# EAGLE design GTwoShield4PATCH2 (EAGLE 9.2.2)

## Sheet 1 of 2
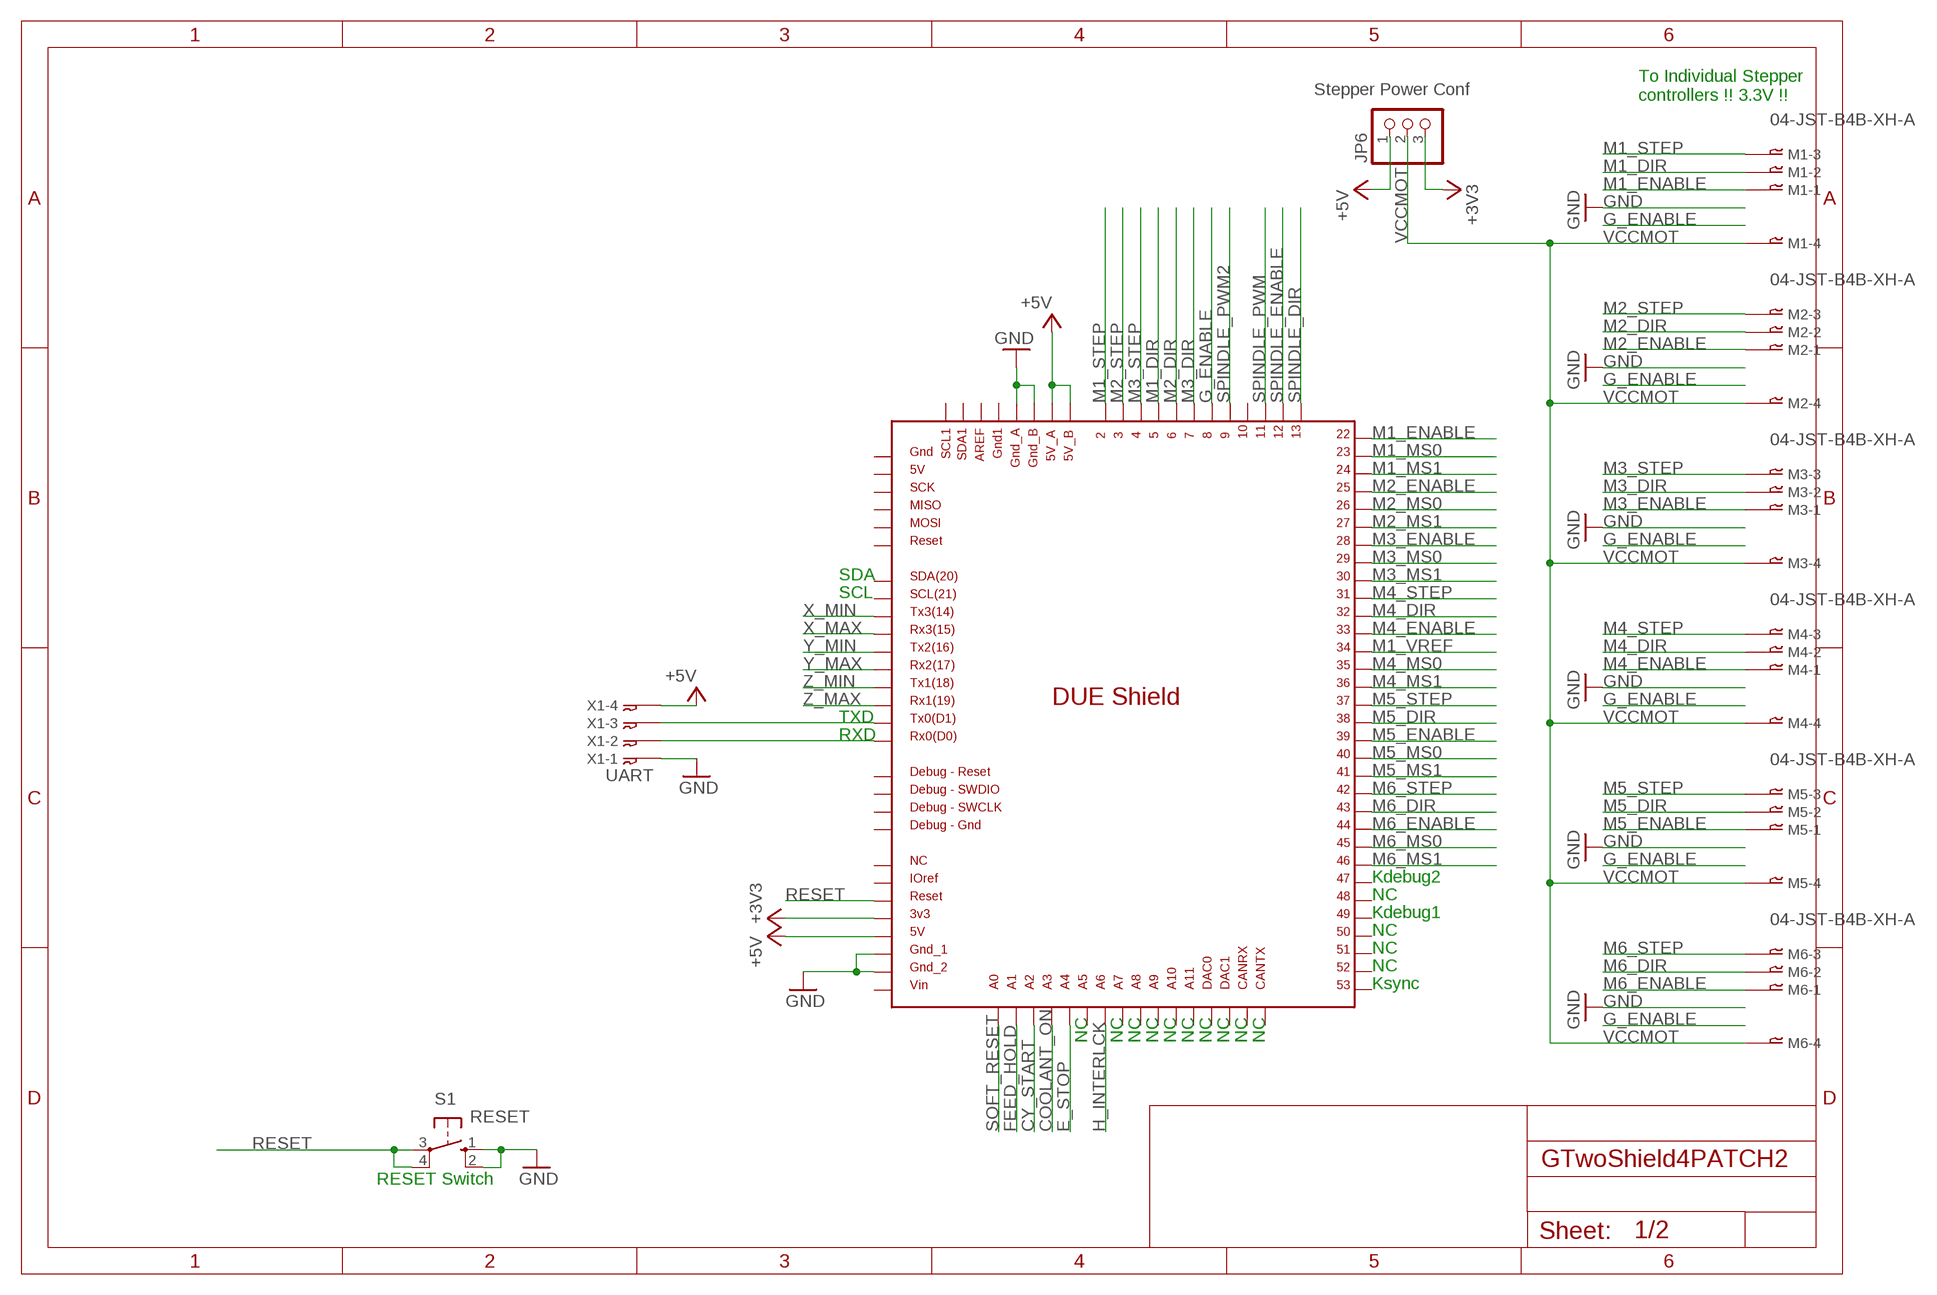
[diagram p0: schematic, sheet 1]

### Parts
JP6  Stepper Power Conf  PINHD-1X3  [1X03]
M1  04-JST-B4B-XH-A  [B4B-XH]
M2  04-JST-B4B-XH-A  [B4B-XH]
M3  04-JST-B4B-XH-A  [B4B-XH]
M4  04-JST-B4B-XH-A  [B4B-XH]
M5  04-JST-B4B-XH-A  [B4B-XH]
M6  04-JST-B4B-XH-A  [B4B-XH]
S1  RESET  10-XX  [B3F-10XX]
U$1  DUE(NORMAL)  [DUE(NORMAL)]
X1  UART  04-JST-B4B-XH-A  [B4B-XH]

### Nets
+3V3: JP6.3 U$1.3V3 ; also sheet 2
+5V [POWER]: JP6.1 U$1.5V U$1.5V_A U$1.5V_B X1.P$4 ; also sheet 2
COOLANT_ON: U$1.A3 ; also sheet 2
CY_START: U$1.A2 ; also sheet 2
E_STOP: U$1.A4 ; also sheet 2
FEED_HOLD: U$1.A1 ; also sheet 2
G_ENABLE: U$1.8
GND [POWER]: S1.1(S) S1.2(S1) U$1.GND_1 U$1.GND_2 U$1.GND_A U$1.GND_B X1.P$1 ; also sheet 2
H_INTERLCK: U$1.A6
M1_DIR: M1.P$2 U$1.5
M1_ENABLE: M1.P$1 U$1.22
M1_MS0: U$1.23
M1_MS1: U$1.24
M1_STEP: M1.P$3 U$1.2
M1_VREF: U$1.34
M2_DIR: M2.P$2 U$1.6
M2_ENABLE: M2.P$1 U$1.25
M2_MS0: U$1.26
M2_MS1: U$1.27
M2_STEP: M2.P$3 U$1.3
M3_DIR: M3.P$2 U$1.7
M3_ENABLE: M3.P$1 U$1.28
M3_MS0: U$1.29
M3_MS1: U$1.30
M3_STEP: M3.P$3 U$1.4
M4_DIR: M4.P$2 U$1.32
M4_ENABLE: M4.P$1 U$1.33
M4_MS0: U$1.35
M4_MS1: U$1.36
M4_STEP: M4.P$3 U$1.31
M5_DIR: M5.P$2 U$1.38
M5_ENABLE: M5.P$1 U$1.39
M5_MS0: U$1.40
M5_MS1: U$1.41
M5_STEP: M5.P$3 U$1.37
M6_DIR: M6.P$2 U$1.43
M6_ENABLE: M6.P$1 U$1.44
M6_MS0: U$1.45
M6_MS1: U$1.46
M6_STEP: M6.P$3 U$1.42
N$6: U$1.TX0 X1.P$3
N$23: U$1.RX0 X1.P$2
RESET: S1.3(P) S1.4(P1) U$1.RESET
SOFT_RESET: U$1.A0 ; also sheet 2
SPINDLE_DIR: U$1.13 ; also sheet 2
SPINDLE_ENABLE: U$1.12 ; also sheet 2
SPINDLE_PWM: U$1.11 ; also sheet 2
SPINDLE_PWM2: U$1.9
VCCMOT: JP6.2 M1.P$4 M2.P$4 M3.P$4 M4.P$4 M5.P$4 M6.P$4
X_MAX: U$1.RX3 ; also sheet 2
X_MIN: U$1.TX3 ; also sheet 2
Y_MAX: U$1.RX2 ; also sheet 2
Y_MIN: U$1.TX2 ; also sheet 2
Z_MAX: U$1.RX1 ; also sheet 2
Z_MIN: U$1.TX1 ; also sheet 2
Unconnected: U$1.5V_ICSP U$1.10 U$1.47 U$1.48 U$1.49 U$1.50 U$1.51 U$1.52 U$1.53 U$1.A5 U$1.A7 U$1.A8 U$1.A9 U$1.A10 U$1.A11 U$1.AREF U$1.CANRX U$1.CANTX U$1.DAC0 U$1.DAC1 U$1.GND1 U$1.GND_DEBUG U$1.GND_ICSP U$1.IOREF U$1.MISO_ICSP U$1.MOSI_ICSP U$1.NC U$1.RESET_DEBUG U$1.RESET_ICSP U$1.SCK_ICSP U$1.SCL U$1.SCL1 U$1.SDA U$1.SDA1 U$1.SWCLK_DEBUG U$1.SWDIO_DEBUG U$1.VIN

### Notes on the sheet
- To Individual Stepper 
  controllers !! 3.3V !!
- SDA
- SCL
- TXD
- RXD
- Kdebug2
- NC
- Kdebug1
- NC
- NC
- NC
- Ksync
- NC | NC | NC | NC | NC | NC | NC | NC | NC | NC
- RESET Switch

## Sheet 2 of 2
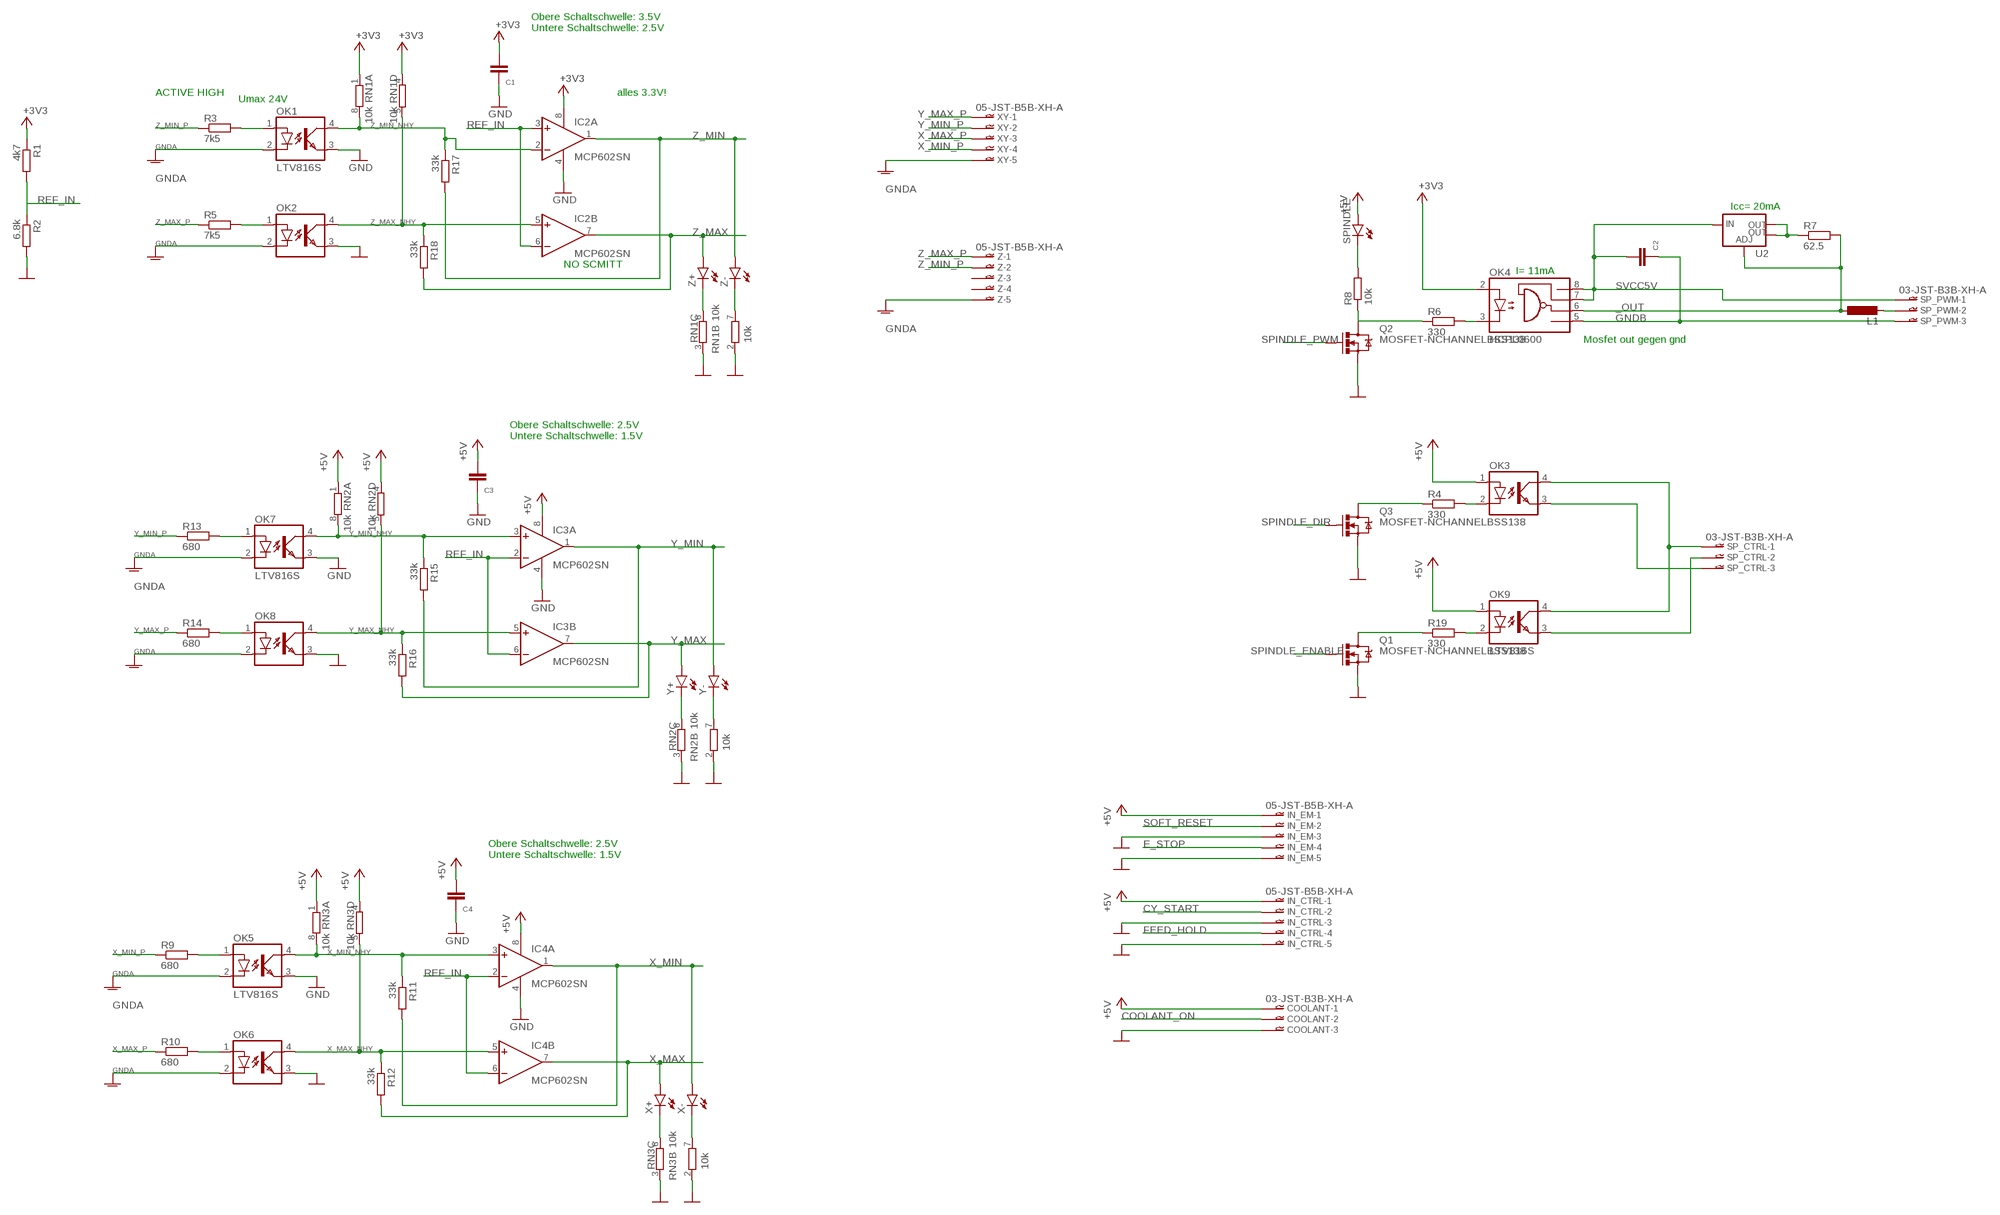
[diagram p1: schematic, sheet 2]

### Parts
C1  100nf  C-EUC0603K  [C0603K]
C2  100nf  C-EUC0603K  [C0603K]
C3  100nf  C-EUC0603K  [C0603K]
C4  100nf  C-EUC0603K  [C0603K]
COOLANT  03-JST-B3B-XH-A  [B3B-XH]
IC2  MCP602SN  [SO08]
IC3  MCP602SN  [SO08]
IC4  MCP602SN  [SO08]
IN_CTRL  05-JST-B5B-XH-A  [B5B-XH]
IN_EM  05-JST-B5B-XH-A  [B5B-XH]
L1  L-EU0207/10  [0207/10]
OK1  LTV816S  [DIL4-SMD]
OK2  LTV816S  [DIL4-SMD]
OK3  LTV816S  [DIL4-SMD]
OK4  HCPL0600  [SOIC08]
OK5  LTV816S  [DIL4-SMD]
OK6  LTV816S  [DIL4-SMD]
OK7  LTV816S  [DIL4-SMD]
OK8  LTV816S  [DIL4-SMD]
OK9  LTV816S  [DIL4-SMD]
Q1  MOSFET-NCHANNELBSS138  [SOT23]
Q2  MOSFET-NCHANNELBSS138  [SOT23]
Q3  MOSFET-NCHANNELBSS138  [SOT23]
R1  4k7  R-EU_R0805  [R0805]
R2  6.8k  R-EU_R0805  [R0805]
R3  7k5  R-EU_R0805  [R0805]
R4  330  R-EU_R0805  [R0805]
R5  7k5  R-EU_R0805  [R0805]
R6  330  R-EU_R0805  [R0805]
R7  62.5  R-EU_R0805  [R0805]
R8  10k  R-EU_R0805  [R0805]
R9  680  R-EU_R0805  [R0805]
R10  680  R-EU_R0805  [R0805]
R11  33k  R-EU_R0805  [R0805]
R12  33k  R-EU_R0805  [R0805]
R13  680  R-EU_R0805  [R0805]
R14  680  R-EU_R0805  [R0805]
R15  33k  R-EU_R0805  [R0805]
R16  33k  R-EU_R0805  [R0805]
R17  33k  R-EU_R0805  [R0805]
R18  33k  R-EU_R0805  [R0805]
R19  330  R-EU_R0805  [R0805]
RN1  10k  4R-N0603-ARC  [0603-ARC]
RN2  10k  4R-N0603-ARC  [0603-ARC]
RN3  10k  4R-N0603-ARC  [0603-ARC]
SP_CTRL  03-JST-B3B-XH-A  [B3B-XH]
SP_PWM  03-JST-B3B-XH-A  [B3B-XH]
SPINDLE  LEDCHIP-LED0805  [CHIP-LED0805]
U2  V_REG_LM1117SOT223  [SOT223]
X+  LEDCHIP-LED0805  [CHIP-LED0805]
X-  LEDCHIP-LED0805  [CHIP-LED0805]
XY  05-JST-B5B-XH-A  [B5B-XH]
Y+  LEDCHIP-LED0805  [CHIP-LED0805]
Y-  LEDCHIP-LED0805  [CHIP-LED0805]
Z  05-JST-B5B-XH-A  [B5B-XH]
Z+  LEDCHIP-LED0805  [CHIP-LED0805]
Z-  LEDCHIP-LED0805  [CHIP-LED0805]

### Nets
+3V3: C1.2 IC2.8(P:V+) OK4.2(A) R1.1 RN1.1 RN1.4 ; also sheet 1
+5V [POWER]: C3.2 C4.2 COOLANT.P$1 IC3.8(P:V+) IC4.8(P:V+) IN_CTRL.P$1 IN_EM.P$1 OK3.1(A) OK9.1(A) RN2.1 RN2.4 RN3.1 RN3.4 SPINDLE.A ; also sheet 1
_OUT: L1.1 OK4.6(VO) R7.2 U2.1(ADJ)
COOLANT_ON: COOLANT.P$2 ; also sheet 1
CY_START: IN_CTRL.P$2 ; also sheet 1
E_STOP: IN_EM.P$4 ; also sheet 1
FEED_HOLD: IN_CTRL.P$4 ; also sheet 1
GND [POWER]: C1.1 C3.1 C4.1 COOLANT.P$3 IC2.4(P:V-) IC3.4(P:V-) IC4.4(P:V-) IN_CTRL.P$3 IN_CTRL.P$5 IN_EM.P$3 IN_EM.P$5 OK1.3(EMIT) OK2.3(EMIT) OK5.3(EMIT) OK6.3(EMIT) OK7.3(EMIT) OK8.3(EMIT) Q1.2(S) Q2.2(S) Q3.2(S) R2.2 RN1.2 RN1.3 RN2.2 RN2.3 RN3.2 RN3.3 ; also sheet 1
GNDA: OK1.2(C) OK2.2(C) OK5.2(C) OK6.2(C) OK7.2(C) OK8.2(C) XY.P$5 Z.P$5
GNDB [POWER]: C2.1 OK4.5(GND) SP_PWM.P$3
N$1: RN1.6 Z+.C
N$2: OK1.1(A) R3.2
N$3: OK2.1(A) R5.2
N$4: RN1.7 Z-.C
N$5: OK9.2(C) R19.2
N$7: Q1.3(D) R19.1
N$8: OK4.3(C) R6.2
N$9: OK5.1(A) R9.2
N$10: OK6.1(A) R10.2
N$11: OK7.1(A) R13.2
N$12: OK8.1(A) R14.2
N$13: RN2.6 Y+.C
N$14: RN2.7 Y-.C
N$15: RN3.6 X+.C
N$16: RN3.7 X-.C
N$17: Q2.3(D) R6.1 R8.1
N$18: OK3.3(EMIT) SP_CTRL.P$3
N$19: L1.2 SP_PWM.P$2
N$20: R8.2 SPINDLE.C
N$21: OK3.2(C) R4.2
N$22: Q3.3(D) R4.1
N$24: R7.1 U2.2(OUT) U2.4(OUT)
N$25: OK3.4(COL) OK9.4(COL) SP_CTRL.P$1
N$26: OK9.3(EMIT) SP_CTRL.P$2
REF_IN: IC2.3(A:+IN) IC2.6(B:-IN) IC3.2(A:-IN) IC3.6(B:-IN) IC4.2(A:-IN) IC4.6(B:-IN) R1.2 R2.1
SOFT_RESET: IN_EM.P$2 ; also sheet 1
SPINDLE_DIR: Q3.1(G) ; also sheet 1
SPINDLE_ENABLE: Q1.1(G) ; also sheet 1
SPINDLE_PWM: Q2.1(G) ; also sheet 1
SVCC5V: C2.2 OK4.7(VE) OK4.8(VCC) SP_PWM.P$1 U2.3(IN)
X_MAX: IC4.7(B:OUT) R12.2 X+.A ; also sheet 1
X_MAX_NHY: IC4.5(B:+IN) OK6.4(COL) R12.1 RN3.5
X_MAX_P: R10.1 XY.P$3
X_MIN: IC4.1(A:OUT) R11.2 X-.A ; also sheet 1
X_MIN_NHY: IC4.3(A:+IN) OK5.4(COL) R11.1 RN3.8
X_MIN_P: R9.1 XY.P$4
Y_MAX: IC3.7(B:OUT) R16.2 Y+.A ; also sheet 1
Y_MAX_NHY: IC3.5(B:+IN) OK8.4(COL) R16.1 RN2.5
Y_MAX_P: R14.1 XY.P$1
Y_MIN: IC3.1(A:OUT) R15.2 Y-.A ; also sheet 1
Y_MIN_NHY: IC3.3(A:+IN) OK7.4(COL) R15.1 RN2.8
Y_MIN_P: R13.1 XY.P$2
Z_MAX: IC2.7(B:OUT) R18.2 Z+.A ; also sheet 1
Z_MAX_NHY: IC2.5(B:+IN) OK2.4(COL) R18.1 RN1.5
Z_MAX_P: R5.1 Z.P$1
Z_MIN: IC2.1(A:OUT) R17.2 Z-.A ; also sheet 1
Z_MIN_NHY: IC2.2(A:-IN) OK1.4(COL) R17.1 RN1.8
Z_MIN_P: R3.1 Z.P$2
Unconnected: Z.P$3 Z.P$4

### Notes on the sheet
- Obere Schaltschwelle: 3.5V
  Untere Schaltschwelle: 2.5V
- ACTIVE HIGH | alles 3.3V!
- Umax 24V
- Icc= 20mA
- NO SCMITT
- I= 11mA
- Mosfet out gegen gnd
- Obere Schaltschwelle: 2.5V
  Untere Schaltschwelle: 1.5V
- Obere Schaltschwelle: 2.5V
  Untere Schaltschwelle: 1.5V

## Library data of the parts
C1-C4 = rcl:C-EU: CAPACITOR, European symbol; SPICEPREFIX: C
COOLANT SP_CTRL SP_PWM = bt_con-jst-xh:03-JST: JST CONNECTOR
IC2-IC4 = linear:MCP602: Single Op Amp 2.7V to 6.0V Single Supply CMOS Source: http://ww1.microchip.com/downloads/en/DeviceDoc/21314g.pdf
IN_CTRL IN_EM XY Z = bt_con-jst-xh:05-JST: JST CONNECTOR
JP6 = pinhead:PINHD-1X3: PIN HEADER
L1 = rcl:L-EU: INDUCTOR, European symbol; SPICEPREFIX: L
M1-M6 X1 = bt_con-jst-xh:04-JST: JST CONNECTOR
OK1-OK3 OK5-OK9 = optocoupler:LTV816: OPTO COUPLER Source: LITEON, LTV816.pdf; SPICEPREFIX: O
OK4 = optocoupler:HCPL0600: HEWLETT PACKARD OPTO COUPLER; MF: AGILENT TECHNOLOGIES; MPN: HCPL-0600-000E; OC_FARNELL: 9994696; OC_NEWARK: 88H7774
Q1-Q3 = BeagleBone_Blue_R3:MOSFET-NCHANNEL: Common NMOSFET Parts MFG P/N Store ID Prod ID FDD8780 TRANS-09984 SI7820DN TRANS-11055 FDS6630A IC-08089 2N7002PW TRANS-11151 FQP30N06L COM-10213 TRANS-10060 BSS123LT1G TRANS-08345 BSS138 TRANS-00830 BS170 2N7000; PROD_ID: TRANS-00830
R1 R2 R11 R12 R15-R18 = rcl:R-EU_: RESISTOR, European symbol; SPICEPREFIX: R
R3-R10 R13 R14 R19 = resistor:R-EU_: RESISTOR, European symbol; SPICEPREFIX: R
RN1-RN3 = resistor-dil:4R-N: Array Chip Resistor Source: RS Component / Phycomp; OC_FARNELL: unknown; OC_NEWARK: unknown
S1 = switch-omron:10-XX: OMRON SWITCH; MPN: B3F-1000; OC_FARNELL: 176432; OC_NEWARK: 36M3542
SPINDLE X+ X- Y+ Y- Z+ Z- = led:LED: LED OSRAM: - CHIPLED LG R971, LG N971, LY N971, LG Q971, LY Q971, LO R971, LY R971 LH N974, LH R974 LS Q976, LO Q976, LY Q976 LO Q996 - Hyper CHIPLED LW Q18S LB Q993, LB Q99A, LB R99A - SideLED LS A670, LO A670, LY A670, LG A670, LP A670 LB A673, LV A673, LT A673, LW A673 LH A674 LY A675 LS A676, LA A676, LO A676, LY A676, LW A676 LS A679, LY A679, LG A679 - Hyper Micro SIDELED® LS Y876, LA Y876, LO Y876, LY Y876 LT Y87S - SmartLED LW L88C, LW L88S LB L89C, LB L89S, LG L890 LS L89K, LO L89K, LY L89K LS L896, LA L896, LO L896, LY L896 - TOPLED LS T670, LO T670, LY T670, LG T670, LP T670 LSG T670, LSP T670, LSY T670, LOP T670, LYG T670 LG T671, LOG T671, LSG T671 LB T673, LV T673, LT T673, LW T673 LH T674 LS T676, LA T676, LO T676, LY T676, LB T676, LH T676, LSB T676, LW T676 LB T67C, LV T67C, LT T67C, LS T67K, LO T67K, LY T67K, LW E67C LS E67B, LA E67B, LO E67B, LY E67B, LB E67C, LV E67C, LT E67C LW T67C LS T679, LY T679, LG T679 LS T770, LO T770, LY T770, LG T770, LP T770 LB T773, LV T773, LT T773, LW T773 LH T774 LS E675, LA E675, LY E675, LS T675 LS T776, LA T776, LO T776, LY T776, LB T776 LHGB T686 LT T68C, LB T68C - Hyper Mini TOPLED® LB M676 - Mini TOPLED Santana® LG M470 LS M47K, LO M47K, LY M47K Source: http://www.osram.convergy.de LUXEON: - LUMILED® LXK2-PW12-R00, LXK2-PW12-S00, LXK2-PW14-U00, LXK2-PW14-V00 LXK2-PM12-R00, LXK2-PM12-S00, LXK2-PM14-U00 LXK2-PE12-Q00, LXK2-PE12-R00, LXK2-PE12-S00, LXK2-PE14-T00, LXK2-PE14-U00 LXK2-PB12-K00, LXK2-PB12-L00, LXK2-PB12-M00, LXK2-PB14-N00, LXK2-PB14-P00, LXK2-PB14-Q00 LXK2-PR12-L00, LXK2-PR12-M00, LXK2-PR14-Q00, LXK2-PR14-R00 LXK2-PD12-Q00, LXK2-PD12-R00, LXK2-PD12-S00 LXK2-PH12-R00, LXK2-PH12-S00 LXK2-PL12-P00, LXK2-PL12-Q00, LXK2-PL12-R00 Source: www.luxeon.com KINGBRIGHT: KA-3528ASYC Source: www.kingbright.com
U2 = SparkFun-IC-Power:V_REG_LM1117: Voltage Regulator LM1117 Standard adjustable voltage regulator but in SMD form. Spark Fun Electronics SKU : COM-00595; PROD_ID: VREG-08170
U$1 = DUElib130425:DUE(NORMAL)

## Net classes
0 default: width 0.127 mm, drill 0.2 mm, clearance 0.127 mm
1 POWER: width 0.381 mm, drill 0.5 mm, clearance 0.254 mm

## Board
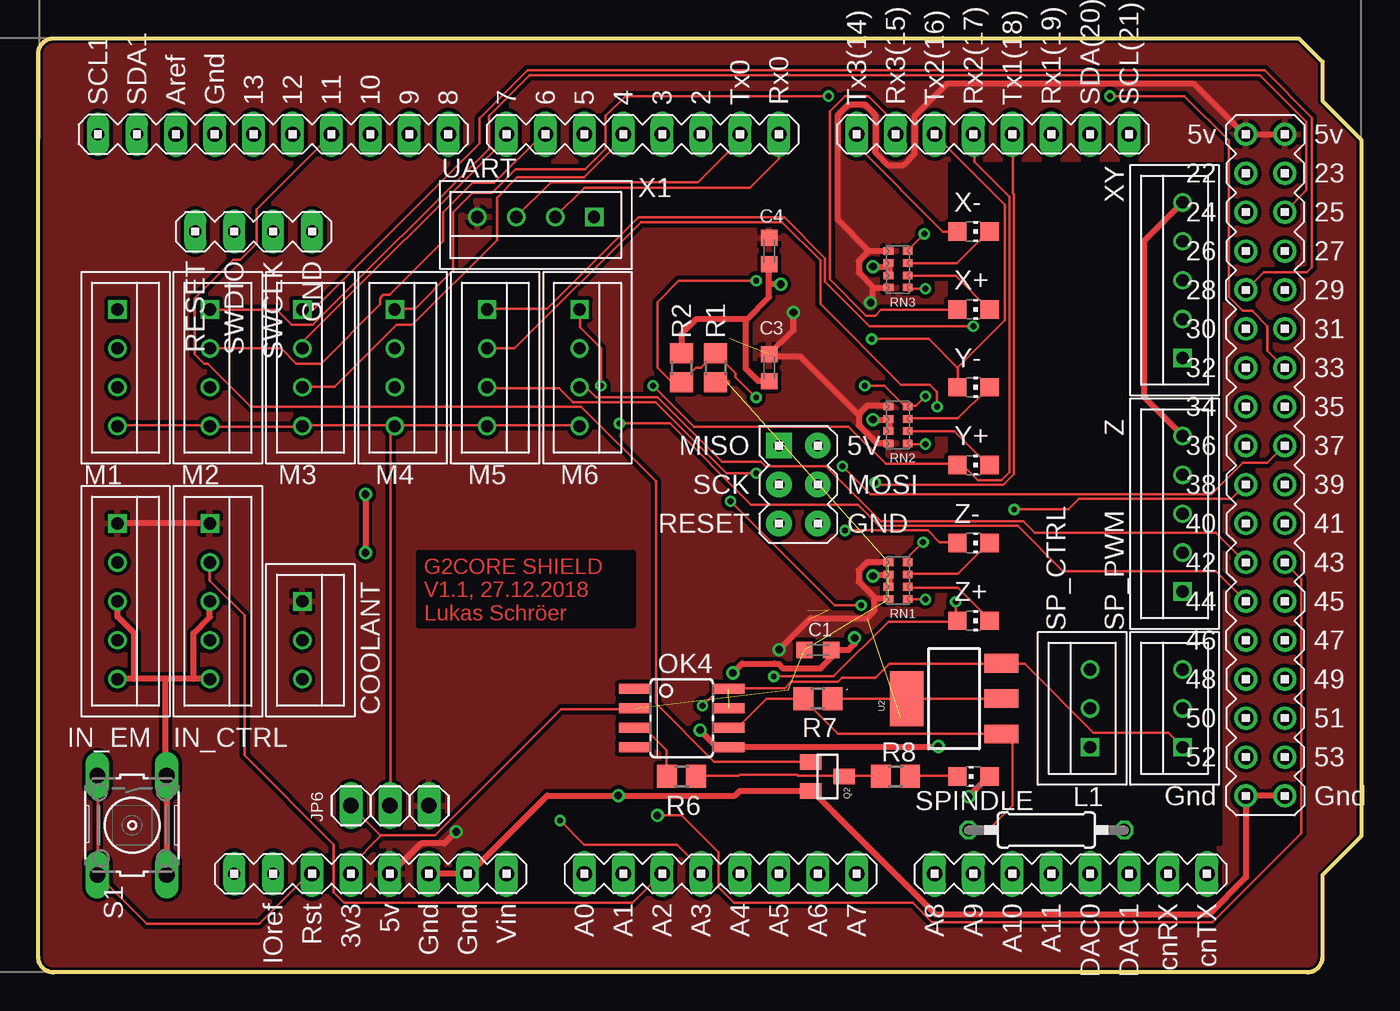
[diagram p2: board, top side]
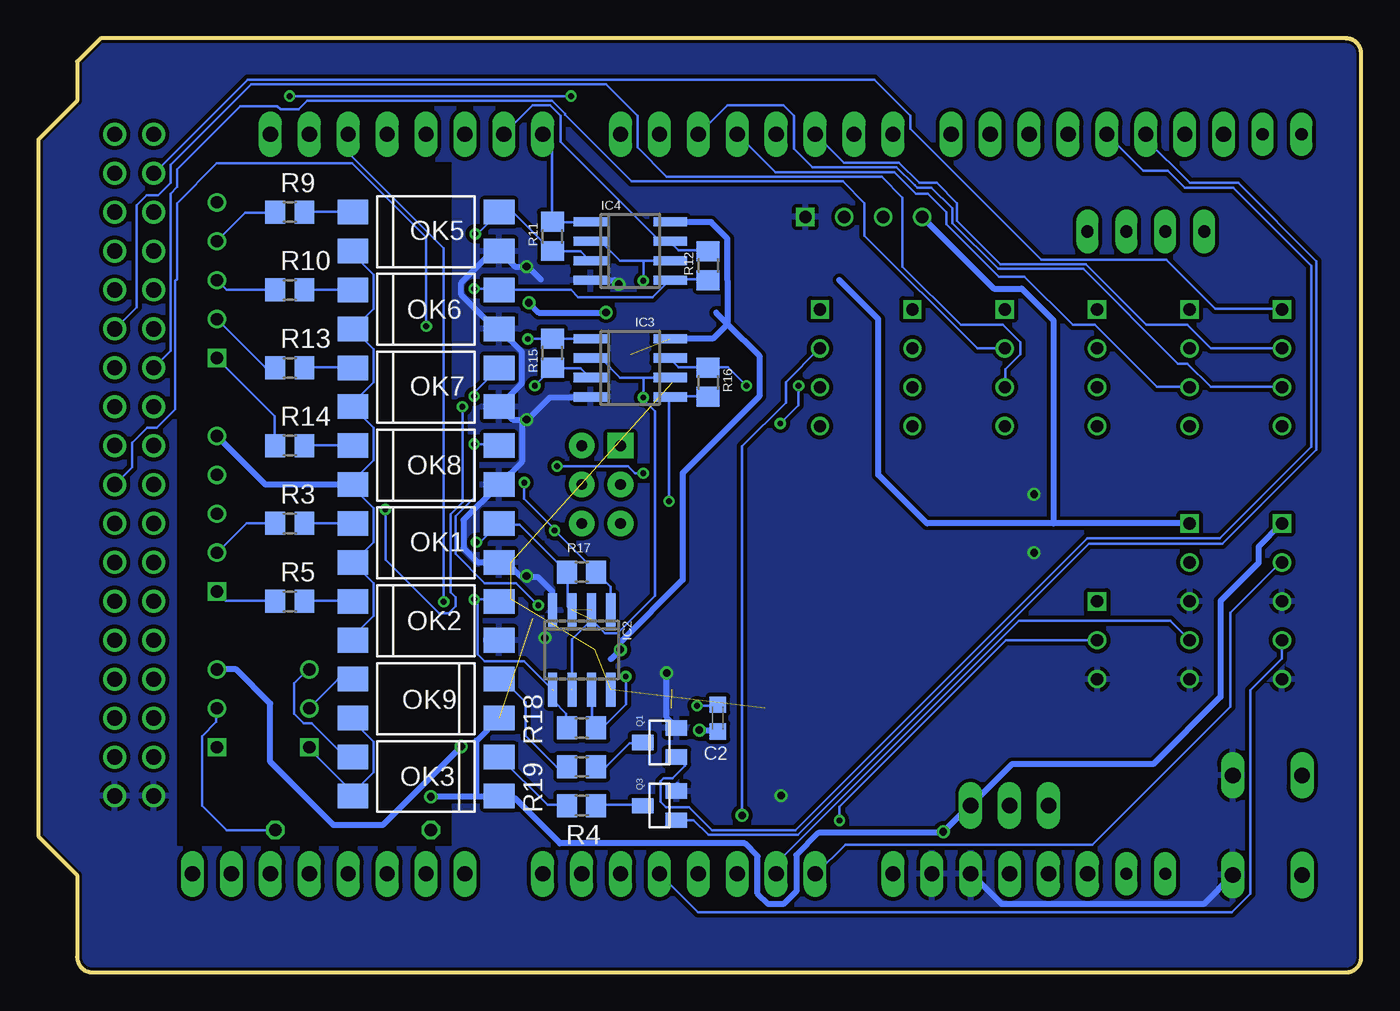
[diagram p3: board, bottom side, seen from below]

Size 86.36 x 60.96 mm. Coordinates in mm from the lower left corner, seen from the top.
Outline: 82.3,60.96 83.82,59.44 83.82,56.9 86.36,54.36 86.36,8.89 83.82,6.35 83.82,1 arc-90 82.82,0 1,0 arc-90 0,1 0,59.96 arc-90 1,60.96 82.3,60.96
Copper layers (1*16): Top 0.035mm / dielectric 1.5mm / Bottom 0.035mm
Design rules "JPC-SparkFun-2-layer-TIGHT *": minimum track width 7mil, minimum drill 15mil, track to track 3.5mil, track to pad 10mil, pad to pad 10mil, via to via 10mil, smd to smd 7mil, copper to edge 7mil, drill to drill 7mil, minimum pad ring 7mil, minimum via ring 7mil, stop-mask expansion 4mil, vias tented up to drill 0.2mm, thermal gap 10mil

### Footprints (pad centres in the part's own frame; a part is rotated, then mirrored left to right if it is on the bottom)
C0603K = smd 1.05 x 1.08: 1 -0.875,0; 2 0.875,0
B3B-XH = drill 0.8 square: P$1 -2.54,0 | drill 0.8: P$2 0,0; P$3 2.54,0
SO08 = smd 0.6 x 2.2: 1 -1.905,-2.6; 2 -0.635,-2.6; 3 0.635,-2.6; 4 1.905,-2.6; 5 1.905,2.6; 6 0.635,2.6; 7 -0.635,2.6; 8 -1.905,2.6
B5B-XH = drill 0.8 square: P$1 -5.08,0 | drill 0.8: P$2 -2.54,0; P$3 0,0; P$4 2.54,0; P$5 5.08,0
1X03 = drill 1.016 long: 1 -2.54,0; 2 0,0; 3 2.54,0
0207/10 = drill 0.813 octagon: 1 -5.08,0; 2 5.08,0
B4B-XH = drill 0.8 square: P$1 -3.81,0 | drill 0.8: P$2 -1.27,0; P$3 1.27,0; P$4 3.81,0
DIL4-SMD = smd 1.6 x 2: 1 -1.27,-4.77; 2 1.27,-4.77; 3 1.27,4.77; 4 -1.27,4.77
SOIC08 = smd 0.66 x 2.032: 1 -1.905,-3.073; 2 -0.635,-3.073; 3 0.635,-3.073; 4 1.905,-3.073; 5 1.905,3.073; 6 0.635,3.073; 7 -0.635,3.073; 8 -1.905,3.073
SOT23 = smd 1 x 1.4: 1 -0.95,-1.1; 2 0.95,-1.1; 3 0,1.1
R0805 = smd 1.3 x 1.5: 1 -0.95,0; 2 0.95,0
0603-ARC = smd 0.5 x 0.65: 1 -1.2,-0.625; 2 -0.4,-0.625; 3 0.4,-0.625; 4 1.2,-0.625; 5 1.2,0.625; 6 0.4,0.625; 7 -0.4,0.625; 8 -1.2,0.625
B3F-10XX = drill 1.016 long: 1 -3.251,2.261; 2 3.251,2.261; 3 -3.251,-2.261; 4 3.251,-2.261
CHIP-LED0805 = smd 1.2 x 1.2: A 0,-1.05; C 0,1.05
SOT223 = smd 1.219 x 2.235: 1 -2.311,-3.099; 2 0,-3.099; 3 2.311,-3.099 | smd 3.6 x 2.2: 4 0,3.099
DUE(NORMAL) = drill 1 long: 2 -16.51,30.48; 3 -19.05,30.48; 3V3 -39.37,-17.78; 4 -21.59,30.48; 5 -24.13,30.48; 5V -36.83,-17.78; 6 -26.67,30.48; 7 -29.21,30.48; 8 -33.02,30.48; 9 -35.56,30.48; 10 -38.1,30.48; 11 -40.64,30.48; 12 -43.18,30.48; 13 -45.72,30.48; A0 -24.13,-17.78; A1 -21.59,-17.78; A2 -19.05,-17.78; A3 -16.51,-17.78; A4 -13.97,-17.78; A5 -11.43,-17.78; A6 -8.89,-17.78; A7 -6.35,-17.78; A8 -1.27,-17.78; A9 1.27,-17.78; A10 3.81,-17.78; A11 6.35,-17.78; AREF -50.8,30.48; CANRX 13.97,-17.78; CANTX 16.51,-17.78; DAC0 8.89,-17.78; DAC1 11.43,-17.78; GND1 -48.26,30.48; GND_1 -34.29,-17.78; GND_2 -31.75,-17.78; RESET -41.91,-17.78; RX0 -11.43,30.48; RX1 6.35,30.48; RX2 1.27,30.48; RX3 -3.81,30.48; SCL 11.43,30.48; SDA 8.89,30.48; TX0 -13.97,30.48; TX1 3.81,30.48; TX2 -1.27,30.48; TX3 -6.35,30.48; VIN -29.21,-17.78 | drill 1: 5V_A 19.05,30.48; 5V_B 21.59,30.48; 22 19.05,27.94; 23 21.59,27.94; 24 19.05,25.4; 25 21.59,25.4; 26 19.05,22.86; 27 21.59,22.86; 28 19.05,20.32; 29 21.59,20.32; 30 19.05,17.78; 31 21.59,17.78; 32 19.05,15.24; 33 21.59,15.24; 34 19.05,12.7; 35 21.59,12.7; 36 19.05,10.16; 37 21.59,10.16; 38 19.05,7.62; 39 21.59,7.62; 40 19.05,5.08; 41 21.59,5.08; 42 19.05,2.54; 43 21.59,2.54; 44 19.05,0; 45 21.59,0; 46 19.05,-2.54; 47 21.59,-2.54; 48 19.05,-5.08; 49 21.59,-5.08; 50 19.05,-7.62; 51 21.59,-7.62; 52 19.05,-10.16; 53 21.59,-10.16; GND_A 19.05,-12.7; GND_B 21.59,-12.7 | drill 0.7 pad 1.676: 5V_ICSP -8.89,5.08; GND_ICSP -8.89,10.16; MOSI_ICSP -8.89,7.62; RESET_ICSP -11.43,5.08; SCK_ICSP -11.43,7.62 | drill 0.8 pad 1.422 long: GND_DEBUG -41.91,24.13; IOREF -44.45,-17.78; NC -46.99,-17.78; RESET_DEBUG -49.53,24.13; SCL1 -55.88,30.48; SDA1 -53.34,30.48; SWCLK_DEBUG -44.45,24.13; SWDIO_DEBUG -46.99,24.13 | drill 0.7 pad 1.676 square: MISO_ICSP -11.43,10.16

### Placement (x,y rotation side)
C1  50.89,21.04 180 top
C2  42,16.6 90 bottom
C3  47.71,39.46 90 top
C4  47.71,47.08 90 top
COOLANT  17.23,21.68 270 top
IC2  50.89,21.04 180 bottom
IC3  47.71,39.46 270 bottom
IC4  47.71,47.08 270 bottom
IN_CTRL  11.2,24.22 270 top
IN_EM  5.17,24.22 270 top
JP6  22.96,10.88 180 top
L1  65.81,9.3 0 top
M1  5.17,39.46 270 top
M2  11.2,39.46 270 top
M3  17.23,39.46 270 top
M4  23.27,39.46 270 top
M5  29.3,39.46 270 top
M6  35.33,39.46 270 top
OK1  61.05,28.03 270 bottom
OK2  61.05,22.95 270 bottom
OK3  61.05,12.79 90 bottom
OK4  42,16.6 270 top
OK5  61.05,48.35 270 bottom
OK6  61.05,43.27 270 bottom
OK7  61.05,38.19 270 bottom
OK8  61.05,33.11 270 bottom
OK9  61.05,17.87 90 bottom
Q1  45.81,15.01 90 bottom
Q2  51.52,12.79 270 top
Q3  45.81,10.88 90 bottom
R1  44.22,39.46 90 top
R2  42,39.46 90 top
R3  69.94,29.3 0 bottom
R4  50.89,10.88 180 bottom
R5  69.94,24.22 0 bottom
R6  42,12.79 180 top
R7  50.89,17.87 180 top
R8  55.97,12.79 0 top
R9  69.94,49.62 0 bottom
R10  69.94,44.54 0 bottom
R11  52.79,48.03 90 bottom
R12  42.63,46.13 90 bottom
R13  69.94,39.46 0 bottom
R14  69.94,34.38 0 bottom
R15  52.79,40.41 90 bottom
R16  42.63,38.51 90 bottom
R17  50.89,26.12 0 bottom
R18  50.89,15.96 0 bottom
R19  50.89,13.42 180 bottom
RN1  56.13,25.57 270 top
RN2  56.13,35.73 270 top
RN3  56.13,45.89 270 top
S1  6.12,9.61 270 top
SP_CTRL  68.67,17.23 90 top
SP_PWM  74.7,17.23 90 top
SPINDLE  61.05,12.79 90 top
U2  59.78,17.87 90 top
U$1  59.78,24.22 0 top
X1  32.47,49.3 180 top
X+  61.05,43.27 270 top
X-  61.05,48.35 270 top
XY  74.7,45.17 90 top
Y+  61.05,33.11 270 top
Y-  61.05,38.19 270 top
Z  74.7,29.93 90 top
Z+  61.05,22.95 270 top
Z-  61.05,28.03 270 top

### Tracks (layer width: path | path; a pad name or v marks a point on that pad's centre or on a via)
+3V3  (5 unrouted)
  Top 0.178: 22.33,8.95 25.91,8.95 34.14,17.18 38.86,17.18 OK4.2 | 22.33,8.95 20.42,10.86 JP6.3 | U$1.3V3 20.42,6.97 22.33,8.88 22.33,8.95
  Top 0.381: 44.97,38.51 R1.1
+5V  (via drill 0.5)  (2 unrouted)
  Top 0.381: 53.57,36.46 53.57,35.7 54.71,34.56 55.47,34.56 RN2.4 | 53.57,36.46 54.1,36.99 55.47,36.99 RN2.1 | 53.57,36.46 53.42,36.54 49.76,40.2 47.85,40.2 C3.2 49.3,41.92 v49.3,43.07 | 54.64,24.42 55.47,24.42 | 54.64,24.42 53.57,25.49 53.57,26.25 54.1,26.78 55.47,26.78 | 54.64,24.42 54.56,24.27 54.56,23.58 54.1,23.13 50.42,23.13 v48.36,21.07 48.39,21.04 | 54.56,44.69 55.47,44.69 RN3.4 | 54.56,44.69 53.57,45.68 53.57,46.44 54.18,47.05 | 54.18,47.05 55.47,47.05 RN3.1 | v54.33,43.7 54.48,43.85 54.48,44.54 54.56,44.69 | 54.18,47.05 54.1,47.21 52.2,49.11 52.2,55.97 52.88,56.65 53.95,56.65 54.64,55.97 54.64,53.53 55.47,52.69 56.46,52.69 57.23,53.45 57.23,55.89 59.36,58.03 75.39,58.03 78.71,54.7 U$1.5V_A U$1.5V_B | v60.73,11.47 62.03,12.76 SPINDLE.A | IN_CTRL.P$1 IN_EM.P$1 | v27.28,9.18 26.52,8.42 24.99,8.42 23.01,6.44 U$1.5V
  Bottom 0.381: IC4.8 45.11,48.96 42.44,48.96 41.38,47.89 41.38,45.17 41.38,42.65 41.36,42.63 41.36,42.32 | 57.76,11.47 56.31,11.47 OK3.1 56.16,11.39 55.28,11.39 52.31,8.42 40.23,8.42 39.4,7.58 39.4,5.14 38.71,4.46 37.72,4.46 36.88,5.3 36.88,7.66 35.43,9.11 27.43,9.11 v27.28,9.18 25.53,10.93 JP6.1 25.37,11.01 22.8,13.59 13.58,13.59 9.18,17.98 9.18,24.23 6.71,26.71 6.71,27.76 IN_EM.P$1 | 57.76,11.47 v60.73,11.47 | 57.76,11.47 57.76,15.13 56.31,16.57 OK9.1 | IN_CTRL.P$1 20.09,29.3 | 20.09,29.3 28.35,29.3 31.52,32.47 31.52,42.63 34.06,45.17 | IC3.8 42.32,41.36 41.36,42.32 | 41.36,42.32 39.29,40.25 39.29,37.59 44.3,32.59 44.3,25.62 48.36,21.55 v48.36,21.07 48.98,20.45 | 41.36,42.32 42.11,43.07 | v54.33,43.7 53.7,43.07 v49.3,43.07 | X1.P$4 23.99,44.63 22.16,44.63 20.09,42.56 20.09,29.3
  pour Top (rank 2): -0.23,61.68 87.72,61.68 87.72,-0.55 -0.23,-0.55
_OUT
  Top 0.178: OK4.6 45.64,15.96 47.55,17.87 R7.2 49.99,17.79 52.2,15.58 62.79,15.58 U2.1 63.35,15.56 63.58,15.38 63.58,10.87 62,9.3 L1.1
COOLANT_ON  (via drill 0.38)
  Top 0.178: v34.06,9.92 35.64,8.34 41.68,8.34 43.27,6.76 U$1.A3
  Bottom 0.178: COOLANT.P$2 23.19,21.68 34.06,10.81 v34.06,9.92
CY_START
  Top 0.178: IN_CTRL.P$2 11.2,25.56 13.46,23.3 13.46,14.16 19.28,8.34 19.28,5.22 19.96,4.53 38.79,4.53 40.69,6.44 U$1.A2
E_STOP
  Bottom 0.178: IN_EM.P$4 5.18,20.46 7.24,18.4 7.24,5.14 8.46,3.92 43.28,3.92 45.8,6.44 U$1.A4
FEED_HOLD
  Bottom 0.178: IN_CTRL.P$4 12.47,22.95 22.35,22.95 38.18,7.12 38.18,6.44 U$1.A1
GND  (via drill 0.5)
  Top 0.381: 10.13,19.16 11.2,19.16 IN_CTRL.P$5 | 10.13,19.16 8.31,19.16 | 8.31,19.16 6.25,19.16 | 6.25,19.16 5.18,19.16 IN_EM.P$5 | 6.25,19.16 6.25,22.14 5.18,23.2 5.18,24.19 IN_EM.P$3 | IN_CTRL.P$3 11.2,23.2 10.13,22.14 10.13,19.16 | U$1.GND_1 U$1.GND_2 28.19,6.51 33.22,11.54 v37.87,11.54 45.49,11.54 45.8,11.85 50.37,11.85 Q2.2 50.6,11.77 58.57,3.8 76.43,3.8 78.83,6.2 U$1.GND_A 78.87,11.54 81.31,11.54 U$1.GND_B | S1.2 S1.1 8.31,12.99 8.31,19.16 | 47.7,44.91 47.7,44.08 46.25,42.63 | 47.7,44.91 47.7,46.29 C4.1 | 46.25,42.63 46.19,42.57 46.19,39.4 47,38.58 C3.1 | RN1.3 55.55,25.18 55.55,25.95 RN1.2 55.32,25.95 54.56,25.95 v54.48,25.87 | RN3.3 55.55,45.53 55.55,46.21 RN3.2 55.4,46.06 v54.48,46.06 | RN2.3 55.55,35.39 55.55,36.08 RN2.2 55.32,36.08 v54.48,36.08 | v48.46,44.91 47.7,44.91 | v45.34,19.54 45.95,20.15 48.03,20.15 48.06,20.13 48.34,20.13 48.62,19.85 51.06,19.85 51.84,20.63 51.84,20.97 C1.1 52.89,21.04 53.29,21.44 v53.29,21.83 | 46.25,42.63 42.95,42.63 42,41.68 R2.2 | v21.36,31.2 v21.36,27.39
  Bottom 0.381: S1.2 10.29,4.46 23.47,4.46 25.45,6.44 U$1.GND_1 | 53.57,45.22 54.33,45.99 v54.48,46.06 55.25,46.06 56.24,47.05 OK5.3 56.46,47.05 56.69,47.05 58.75,45 58.75,44.23 56.46,41.95 OK6.3 56.24,41.95 54.79,40.5 54.79,38.44 56.16,37.07 OK7.3 56.24,36.92 55.4,36.08 v54.48,36.08 | v54.48,36.08 54.79,35.93 54.79,33.34 56.24,31.89 OK8.3 56.39,31.74 58.6,29.53 58.6,27.7 57.68,26.78 56.46,26.78 OK1.3 56.24,26.71 55.7,26.71 54.86,25.87 v54.48,25.87 54.42,25.81 53.75,25.81 52.79,24.85 IC2.4 | IC3.4 50.37,37.53 52.96,37.53 54.33,36.16 v54.48,36.08 | IC4.4 48.73,45.17 v48.46,44.91 | 44.65,12.23 44.65,11.85 | 44.65,15.89 Q1.2 44.81,16.12 45.34,16.65 v45.34,19.54
  pour Bottom: -0.23,61.68 87.72,61.68 87.72,-0.55 -0.23,-0.55
GNDA
  Top 0.381: XY.P$5 72.16,47.71 72.16,37.55 Z.P$5
  Bottom 0.178: OK2.2 65.76,21.68 65.76,21.98 64.47,23.28 64.47,25.41 65.76,26.71 OK1.2 65.76,26.78 64.47,28.08 64.47,30.29 65.76,31.58 65.76,31.81 OK8.2 65.76,31.89 65.76,32.12 64.47,33.41 64.47,35.55 65.76,36.84 OK7.2 65.76,36.92 65.76,37.22 64.47,38.52 64.47,40.65 65.76,41.95 OK6.2 65.76,42.02 64.47,43.32 64.47,45.53 65.76,46.82 65.76,47.05 OK5.2
  Bottom 0.381: OK8.2 71.53,31.84 Z.P$5
GNDB  (via drill 0.5)
  Top 0.381: v43.21,15.81 44.27,14.74 45.03,14.74 OK4.5 45.26,14.74 v58.75,14.74
  Bottom 0.381: v43.21,15.81 42.06,15.81 C2.1 | v58.75,14.74 63.88,9.61 67.08,9.61 71.21,13.74 71.21,17.55 73.43,19.77 SP_PWM.P$3
M1_DIR
  Bottom 0.178: M1.P$2 9.83,40.73 11.35,42.25 14.02,42.25 17.98,46.21 23.55,46.21 26.38,49.05 26.38,50.19 27.71,51.52 28.85,51.52 30.18,52.84 33.76,52.84 35.59,54.67 U$1.5
M1_ENABLE
  Bottom 0.178: M1.P$1 5.18,43.32 9.53,43.32 12.73,46.52 20.88,46.52 29.41,55.05 29.41,55.89 31.78,58.25 72.69,58.25 78.79,52.16 U$1.22
M1_STEP
  Bottom 0.178: M1.P$3 5.18,38.21 9.83,38.21 11.35,39.74 11.96,39.74 18.14,45.91 23.7,45.91 26.68,48.89 26.68,49.86 28.04,51.22 28.98,51.22 29.12,51.36 29.15,51.36 30.33,52.54 35.81,52.54 37.03,53.76 37.03,55.89 37.72,56.58 41.38,56.58 43.21,54.75 U$1.2
M2_DIR
  Top 0.178: M2.P$2 15.85,40.73 16.84,39.74 18.47,39.74 22.32,43.6 22.32,44.01 22.52,44.21 22.94,44.21 26.44,47.71 26.44,49.62 28.35,51.52 29.77,51.52 32.92,54.67 33.07,54.67 U$1.6
M2_ENABLE
  Top 0.178: M2.P$1 11.2,43.24 15.54,43.24 16.54,42.25 17.91,42.25 29.41,53.76 29.41,55.89 32.08,58.56 79.73,58.56 82.78,55.51 82.78,51.03 U$1.25
M2_STEP
  Bottom 0.178: M2.P$3 11.2,38.21 13.34,38.21 17.37,42.25 18.82,42.25 21.98,45.41 23.66,45.41 27.08,48.83 27.08,49.62 28.27,50.81 29.06,50.81 30.48,52.23 38.25,52.23 40.69,54.67 U$1.3
M3_DIR
  Top 0.178: M3.P$2 17.3,40.73 17.3,41.19 30.56,54.44 30.56,54.67 U$1.7
M3_ENABLE
  Top 0.178: M3.P$1 17.3,43.32 18,43.32 28.79,54.11 28.79,55.73 31.93,58.86 80.06,58.86 83.13,55.79 83.13,46.01 82.8,45.68 80.01,45.68 78.87,44.54 U$1.28
M3_STEP
  Top 0.178: M3.P$3 17.3,38.21 19.35,38.21 23.39,42.25 24.4,42.25 29.93,47.79 29.93,50.57 31.24,51.88 35.61,51.88 38.18,54.44 38.18,54.67 U$1.4
M4_DIR
  Bottom 0.178: M4.P$2 25.07,40.73 32.42,48.08 32.42,50.2 33.85,51.63 47.63,51.63 51.97,55.97 51.97,56.04 52.81,56.88 68.81,56.88 69.35,56.34 70.55,56.34 70.76,56.54 73.18,56.54 77.29,52.43 77.29,51.26 77.72,50.83 77.72,40.58 78.79,39.51 U$1.32
M4_ENABLE  (via drill 0.38)
  Top 0.178: v51.59,57.19 38.33,57.19 37.03,55.89 37.03,53.76 36.33,53.06 35.7,52.43 31.15,52.43 29.62,50.89 28.35,50.89 27.08,49.62 27.08,45.81 24.59,43.32 23.32,43.32 M4.P$1 | v69.95,57.19 74.83,57.19 77.72,54.29 77.72,44.08 78.64,43.17 79.25,43.17 80.24,42.18 80.24,40.58 81.31,39.51 U$1.33
  Bottom 0.178: v69.95,57.19 v51.59,57.19
M4_STEP
  Bottom 0.178: M4.P$3 23.24,38.21 23.24,39.36 22.25,40.35 22.25,41.11 23.39,42.25 26.14,42.25 29.93,46.05 29.93,50.57 31.29,51.93 45.34,51.93 47.24,53.83 47.24,55.89 49.3,57.95 72.48,57.95 77.72,52.7 77.72,51.52 78.54,50.71 79.28,50.71 79.92,50.07 79.92,43.41 81.31,42.02 U$1.31
M5_DIR  (via drill 0.38)
  Top 0.178: M5.P$2 31.09,40.73 39.33,48.97 48.55,48.97 51.05,46.47 51.05,43.62 56.31,38.37 58.22,38.37 58.67,37.91 v58.67,36.92 | v63.7,30.21 67.26,30.21 67.95,30.9 77.88,30.9 78.79,31.81 U$1.38
  Bottom 0.178: v58.67,36.92 58.67,30.67 59.44,29.91 59.44,24.8 59.13,24.5 59.13,23.89 59.59,23.43 60.2,23.43 63.7,26.94 v63.7,30.21
M5_ENABLE  (via drill 0.38)
  Top 0.178: v61.04,42.18 54.25,42.18 51.36,45.07 51.36,46.62 48.7,49.28 39.18,49.28 33.22,43.32 29.34,43.32 M5.P$1
  Bottom 0.178: U$1.39 81.31,31.89 80.24,32.96 80.24,34.56 79.25,35.55 78.64,35.55 77.42,36.77 77.42,45.12 77.31,45.24 77.31,50.19 74.7,52.79 65.86,52.79 61.04,47.97 v61.04,42.18
M5_STEP  (via drill 0.38)
  Top 0.178: v46.86,32.58 44.93,32.58 40.28,37.22 34.9,37.22 33.99,38.14 29.34,38.14 M5.P$3 | v52.5,33.03 54.33,31.2 76.58,31.2 78.64,33.26 80.24,33.26 81.31,34.33 U$1.37
  Bottom 0.178: v46.86,32.58 47.4,32.58 47.85,33.03 v52.5,33.03
M6_DIR  (via drill 0.5)
  Top 0.178: U$1.43 82.46,25.67 82.46,9.08 76.65,3.26 58.35,3.26 57.08,4.53 45.42,4.53 44.4,5.55 44.4,7.85 42,10.25 v40.41,10.25
  Bottom 0.178: M6.P$2 35.36,40.73 37.57,38.52 37.57,37.19 40.41,34.34 v40.41,10.25
M6_ENABLE  (via drill 0.38)
  Top 0.178: v36.73,38.29 36.73,40.73 35.36,42.1 35.36,43.24 M6.P$1 | v37.92,35.83 41.22,35.83 46.53,30.52 53.49,30.52 54.86,29.15 63.93,29.15 66.89,26.19 76.87,26.19 78.79,24.27 U$1.44
  Bottom 0.178: v37.92,35.83 36.73,37.02 v36.73,38.29
M6_STEP
  Top 0.178: M6.P$3 35.36,38.14 35.81,38.14 36.42,37.53 40.44,37.53 44.63,33.34 47.17,33.34 47.47,33.03 51.44,33.03 55.02,29.45 64.31,29.45 65.06,28.7 76.87,28.7 78.79,26.78 U$1.42
N$1
  Top 0.178: RN1.6 56.77,25.11 60.05,25.11 62.03,23.13 62.03,22.97 Z+.C
N$2
  Bottom 0.178: OK1.1 R3.2
N$3
  Bottom 0.178: R5.2 68.96,24.27 65.84,24.27 OK2.1
N$4
  Top 0.178: RN1.7 56.77,26.02 60.05,26.02 62.03,28 Z-.C
N$5
  Bottom 0.178: R19.2 52.53,13.42 54.56,15.46 54.56,17.64 56.01,19.09 56.24,19.09 OK9.2
N$6
  Top 0.178: X1.P$3 33.48,51.57 43.08,51.57 45.81,54.31 U$1.TX0
N$7
  Bottom 0.178: Q1.3 46.94,14.97 47.76,14.97 49.31,13.42 R19.1
N$8
  Top 0.178: OK4.3 39.55,15.96 41,14.52 41,12.84 R6.2
N$9
  Bottom 0.178: R9.2 68.96,49.64 65.84,49.64 OK5.1
N$10
  Bottom 0.178: R10.2 OK6.1
N$11
  Bottom 0.178: R13.2 68.96,39.51 65.84,39.51 OK7.1
N$12
  Bottom 0.178: R14.2 68.96,34.4 65.84,34.4 OK8.1
N$13
  Top 0.178: RN2.6 56.77,35.32 59.82,35.32 62.03,33.11 Y+.C
N$14
  Top 0.178: RN2.7 56.77,36.16 60.05,36.16 62.03,38.14 Y-.C
N$15
  Top 0.178: RN3.6 56.77,45.45 59.89,45.45 62.03,43.32 X+.C
N$16
  Top 0.178: RN3.7 56.77,46.29 59.97,46.29 62.03,48.35 X-.C
N$17
  Top 0.178: R8.1 55.02,12.84 52.65,12.84 Q2.3 52.58,12.84 49.61,12.84 49.53,12.92 45.8,12.92 45.72,12.84 42.98,12.84 R6.1
N$18
  Bottom 0.178: OK3.3 66.29,14.06 68.5,16.27 69.04,16.27 69.65,16.88 69.65,18.86 68.73,19.77 SP_CTRL.P$3
N$19
  Bottom 0.178: SP_PWM.P$2 74.75,17.18 74.75,16.34 75.67,15.43 75.67,10.88 74.08,9.3 L1.2
N$20
  Top 0.178: SPINDLE.C 59.97,12.84 56.92,12.84 R8.2
N$21
  Bottom 0.178: R4.2 51.9,10.93 53.11,10.93 56.24,14.06 OK3.2
N$22
  Bottom 0.178: Q3.3 46.94,10.93 49.92,10.93 R4.1
N$23
  Top 0.178: U$1.RX0 48.35,53.11 46.44,51.21 35.65,51.21 X1.P$2
N$24
  Top 0.178: R7.1 U2.4 U2.2
N$25
  Bottom 0.178: SP_CTRL.P$1 68.73,14.67 65.84,11.77 65.84,11.54 OK3.4 65.76,11.77 64.47,13.07 64.47,15.05 65.76,16.34 65.76,16.57 OK9.4
N$26
  Bottom 0.178: OK9.3 65.84,19.09 66.83,19.09 68.66,17.26 SP_CTRL.P$2
NONE
  cutout Top: 67.08,52.79 77.24,52.79 77.24,8.34 59.46,8.34 59.46,52.79
  cutout Bottom: 59.46,52.79 77.24,52.79 77.24,8.34 59.46,8.34
  cutout Top: 24.85,27.39 38.82,27.39 38.82,22.63 24.85,22.63
REF_IN  (via drill 0.38)  (2 unrouted)
  Top 0.178: v46.86,45.14 41.81,45.14 40.41,43.74 40.41,39.46 41.36,38.51 R2.1 42.95,39.46 43.27,39.46 R1.2 45.52,39.11 45.52,38.86 v46.86,37.52
  Bottom 0.178: 51.51,18.48 51.51,21.75 50.25,23.01 49.38,22.14 48.54,22.14 46.1,24.57 46.1,36.61 46.86,37.38 v46.86,37.52 46.86,38.72 46.76,38.82 | 46.86,46.44 48.39,46.44 49.61,47.66 50.29,47.66 IC4.2 | 46.86,46.44 IC4.6 | 46.76,38.82 48.39,38.82 49.61,40.04 50.29,40.04 IC3.2 | 46.76,38.82 IC3.6 | v46.86,45.14 46.86,46.44
RESET
  Top 0.178: U$1.RESET 17.68,6.44 14.43,3.19 7.06,3.19 3.89,6.36 S1.4 3.89,6.44 3.89,12.84 S1.3
SOFT_RESET
  Bottom 0.178: IN_EM.P$2 5.26,26.76 8.55,23.47 8.55,17.35 17.55,8.34 33.68,8.34 35.59,6.44 U$1.A0
SPINDLE_DIR
  Bottom 0.178: Q3.1 44.65,9.94 43.59,9.94 42.62,8.98 36.78,8.98 17.77,27.99 9.06,27.99 2.92,34.12 2.92,46.42 8.03,51.52 11.2,51.52 14.06,54.38 U$1.13
SPINDLE_ENABLE
  Bottom 0.178: U$1.12 14.22,52.32 12.63,52.32 11.52,51.21 8.34,51.21 3.26,46.13 3.26,34.32 9.23,28.35 17.87,28.35 36.93,9.28 42.37,9.28 43.87,10.78 45.38,10.78 45.75,11.14 45.75,12.48 45.55,12.68 44.97,12.68 44.15,13.5 Q1.1
SPINDLE_PWM
  Top 0.178: Q2.1 50.37,13.75 44.12,13.75 40.31,17.56 40.31,32.04 35.43,36.92 13.87,36.92 11.05,39.74 10.82,39.74 10.21,40.35 10.21,44.01 12.73,46.52 13.18,46.52 14.25,47.59 14.25,49.8 19.13,54.67 U$1.11
SVCC5V  (via drill 0.38)  (1 unrouted)
  Top 0.178: v43.36,17.41 44.42,18.48 45.03,18.48 OK4.8 45.11,18.55 48.74,18.55 49.15,18.96 52.2,18.96 52.48,19.24 54.64,19.24 55.55,20.15 62.87,20.15 U2.3 62.94,20.15 64.39,20.15 68.88,15.66 73.76,15.66 74.68,14.74 SP_PWM.P$1
  Bottom 0.178: v43.36,17.41 42.06,17.41 C2.2
VCCMOT
  Top 0.178: M6.P$4 35.28,35.7 29.34,35.7 M5.P$4 29.26,35.7 23.32,35.7 M4.P$4 | M1.P$4 5.18,35.7 11.2,35.7 M2.P$4 11.28,35.62 17.15,35.62 M3.P$4 17.3,35.7 23.24,35.7 M4.P$4 | JP6.2 23.01,10.93 23.01,35.62 M4.P$4
X_MAX
  Top 0.178: X+.A 59.97,43.24 55.02,43.24 54.64,42.86 54.03,42.86 51.66,45.22 51.66,56.2 52.65,57.19 54.18,57.19 55.93,55.44 55.93,54.75 U$1.RX3
  Bottom 0.178: R12.2 42.67,47.13 44.58,47.13 45.11,47.66 IC4.7 45.19,47.74 45.8,47.74 52.27,54.22 52.27,55.89 52.96,56.58 54.1,56.58 55.93,54.75 U$1.RX3
X_MAX_NHY  (via drill 0.38)
  Top 0.178: v57.91,44.61 56.77,44.61 RN3.5
  Bottom 0.178: v57.91,44.61 56.39,44.61 56.31,44.54 OK6.4 51.59,44.54 51.12,44.07 46.27,44.07 45.19,45.15 IC4.5 45.11,45.22 42.67,45.22 R12.1
X_MAX_P
  Bottom 0.178: R10.1 74.07,44.54 XY.P$3
X_MIN
  Top 0.178: X-.A 59.06,48.35 53.49,53.91 53.49,54.67 U$1.TX3
  Bottom 0.178: IC4.1 50.37,48.96 52.73,48.96 R11.2 52.81,49.03 52.81,54.06 53.42,54.67 U$1.TX3
X_MIN_NHY  (via drill 0.38)
  Top 0.178: v57.84,48.2 56.77,47.13 RN3.8
  Bottom 0.178: v57.84,48.2 57.68,48.2 56.31,49.57 OK5.4 56.24,49.57 55.32,49.57 52.81,47.05 R11.1 52.73,47.05 50.98,47.05 50.37,46.44 IC4.3
X_MIN_P
  Bottom 0.178: XY.P$4 72.85,49.57 70.94,49.57 R9.1
Y_MAX  (via drill 0.38)
  Top 0.178: U$1.RX2 61.11,54.67 61.11,52.92 63.4,50.63 63.4,32.65 62.87,32.12 61.34,32.12 60.35,33.11 Y+.A 59.97,33.18 55.32,33.18 52.88,35.62 42.8,35.62 v40.13,38.29
  Bottom 0.178: IC3.7 45.11,40.04 44.58,39.51 42.58,39.51 | v40.13,38.29 41.35,39.51 41.68,39.51 42.58,39.51 | 42.58,39.51 R16.2
Y_MAX_NHY  (via drill 0.38)
  Top 0.178: v57.91,34.48 56.77,34.48 RN2.5 | v53.72,23.96 51.97,23.96 v45.19,30.75
  Bottom 0.178: OK8.4 56.31,34.4 56.39,34.48 v57.91,34.48 57.91,30.97 59.13,29.76 59.13,27.32 57.23,25.41 55.17,25.41 v53.72,23.96 | R16.1 42.67,37.6 45.11,37.6 IC3.5 45.19,37.53 v45.19,30.75
Y_MAX_P
  Bottom 0.178: R14.1 70.94,34.4 70.94,36.31 74.68,40.04 XY.P$1
Y_MIN  (via drill 0.38)
  Top 0.178: 60.05,39.51 60.05,38.21 Y-.A | 60.05,39.51 63.09,42.56 63.09,50.1 58.52,54.67 U$1.TX2 | v54.41,41.34 58.14,41.34 59.97,39.51 60.05,39.51
  Bottom 0.178: IC3.1 50.37,41.34 52.73,41.34 R15.2 52.81,41.34 v54.41,41.34
Y_MIN_NHY  (via drill 0.38)
  Top 0.178: v57.91,37.6 57.3,36.99 56.77,36.99 RN2.8 56.69,36.99 56.54,36.99 55.25,38.29 v53.95,38.29
  Bottom 0.178: v57.91,37.6 57.91,37.83 56.31,39.43 OK7.4 | IC3.3 50.37,38.82 50.98,39.43 52.73,39.43 R15.1 52.81,39.43 v53.95,38.29
Y_MIN_P
  Bottom 0.178: R13.1 70.94,39.51 71.55,39.51 74.68,42.63 XY.P$2
Z_MAX  (via drill 0.38)
  Top 0.178: v59.89,24.19 59.89,22.97 Z+.A 59.97,22.9 55.5,22.9 51.92,19.32 v48.01,19.32
  Bottom 0.178: v48.01,19.32 48.01,17.49 49.53,15.96 R18.2 49.99,16.04 50.22,16.27 50.22,18.4 IC2.7 | v59.89,24.19 59.89,47.26 66.07,53.43 66.07,54.67 U$1.RX1
Z_MAX_NHY  (via drill 0.38)  (2 unrouted)
  Top 0.178: v57.91,24.35 56.77,24.35 RN1.5
  Bottom 0.178: OK2.4 56.31,24.27 56.39,24.35 v57.91,24.35 57.68,24.27 57.68,20.76 57.23,20.31 54.64,20.31 52.81,18.48 | 52.73,18.4 52.73,17.72 51.89,16.88 51.89,15.96 R18.1
Z_MAX_P
  Bottom 0.178: R5.1 70.94,24.27 74.14,24.27 74.68,24.8 Z.P$1
Z_MIN  (via drill 0.38)
  Top 0.178: v52.65,28.84 58.06,28.84 58.83,28.08 59.97,28.08 Z-.A | v54.64,31.97 54.79,31.81 63.02,31.81 63.7,32.5 63.7,50.79 63.63,50.86 63.63,54.67 U$1.TX1
  Bottom 0.178: v54.64,31.97 54.64,30.9 52.65,28.92 v52.65,28.84 49.99,26.17 R17.2 49.91,26.1 49,25.18 49,23.66 IC2.1
Z_MIN_NHY  (via drill 0.38)  (1 unrouted)
  Top 0.178: v57.76,28.08 56.77,27.09 56.77,26.78 RN1.8
  Bottom 0.178: v57.76,28.08 57.53,28.08 56.31,29.3 OK1.4 56.24,29.22 54.94,29.22 51.89,26.17 R17.1 51.82,26.1 51.82,23.89 51.59,23.66
Z_MIN_P
  Bottom 0.178: R3.1 72.77,29.3 74.68,27.39 Z.P$2

### Text on the board
Top: G2CORE SHIELD / V1.1, 27.12.2018 / Lukas Schröer
tStop: G2CORE SHIELD / V1.1, 27.12.2018 / Lukas Schröer
tSilk: 1 | 1 | Motor | Coolant | 1 | 1 | Xmn | Xmx | Ymn | Ymx | Zmn | Zmx | Emrg | Hlck | Spin | Dir | Pwm | Pw2 | Cool | 1 | 1 | Xmn | Xmx | Ymn | Ymx | Zmn | Zmx | EStp | Hlck | SR | Hold | Run | EStp | RST | GTwo / CNC Shield for / Arduino DUE | 3.3V | 5V